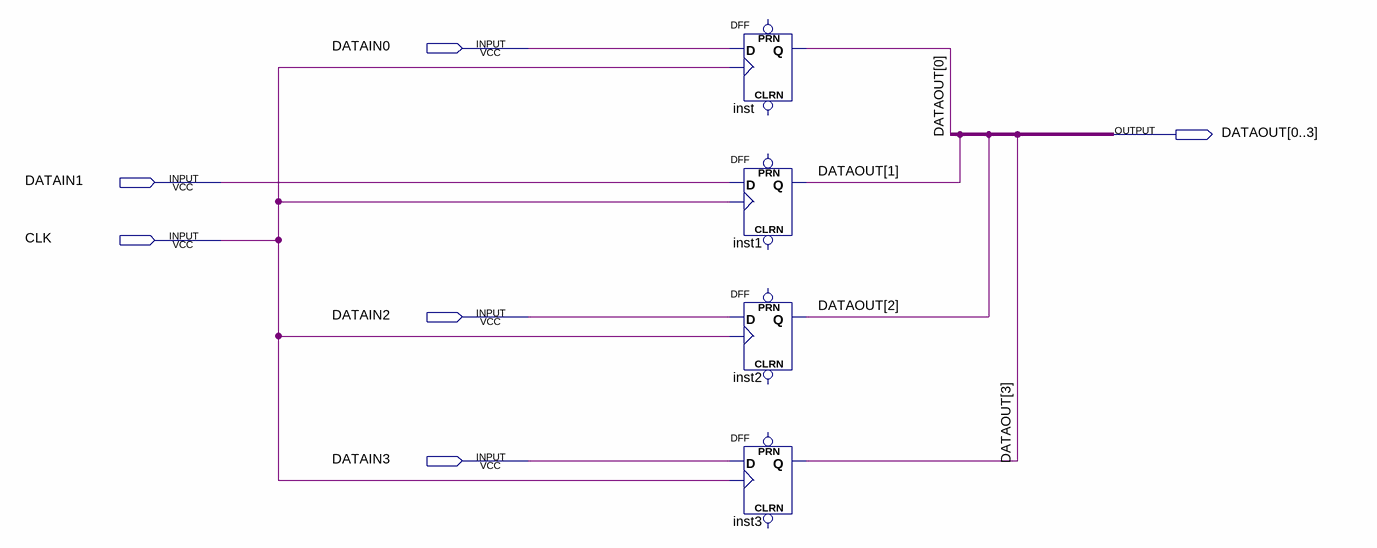
[diagram p0: schematic sheet]
// Quartus schematic copia4bits.bdf as structural Verilog: 4 symbols, 6 pins
module copia4bits (
  input  DATAIN0,
  input  DATAIN1,
  input  CLK,
  input  DATAIN2,
  input  DATAIN3,
  output [0:3] DATAOUT
);

  DFF inst (.CLK(CLK), .D(DATAIN0), .Q(DATAOUT[0]));  // open: CLRN, PRN
  DFF inst1 (.CLK(CLK), .D(DATAIN1), .Q(DATAOUT[1]));  // open: CLRN, PRN
  DFF inst2 (.CLK(CLK), .D(DATAIN2), .Q(DATAOUT[2]));  // open: CLRN, PRN
  DFF inst3 (.CLK(CLK), .D(DATAIN3), .Q(DATAOUT[3]));  // open: CLRN, PRN
endmodule
